# Altium schematic sheet adc front end.SchDoc
size A1
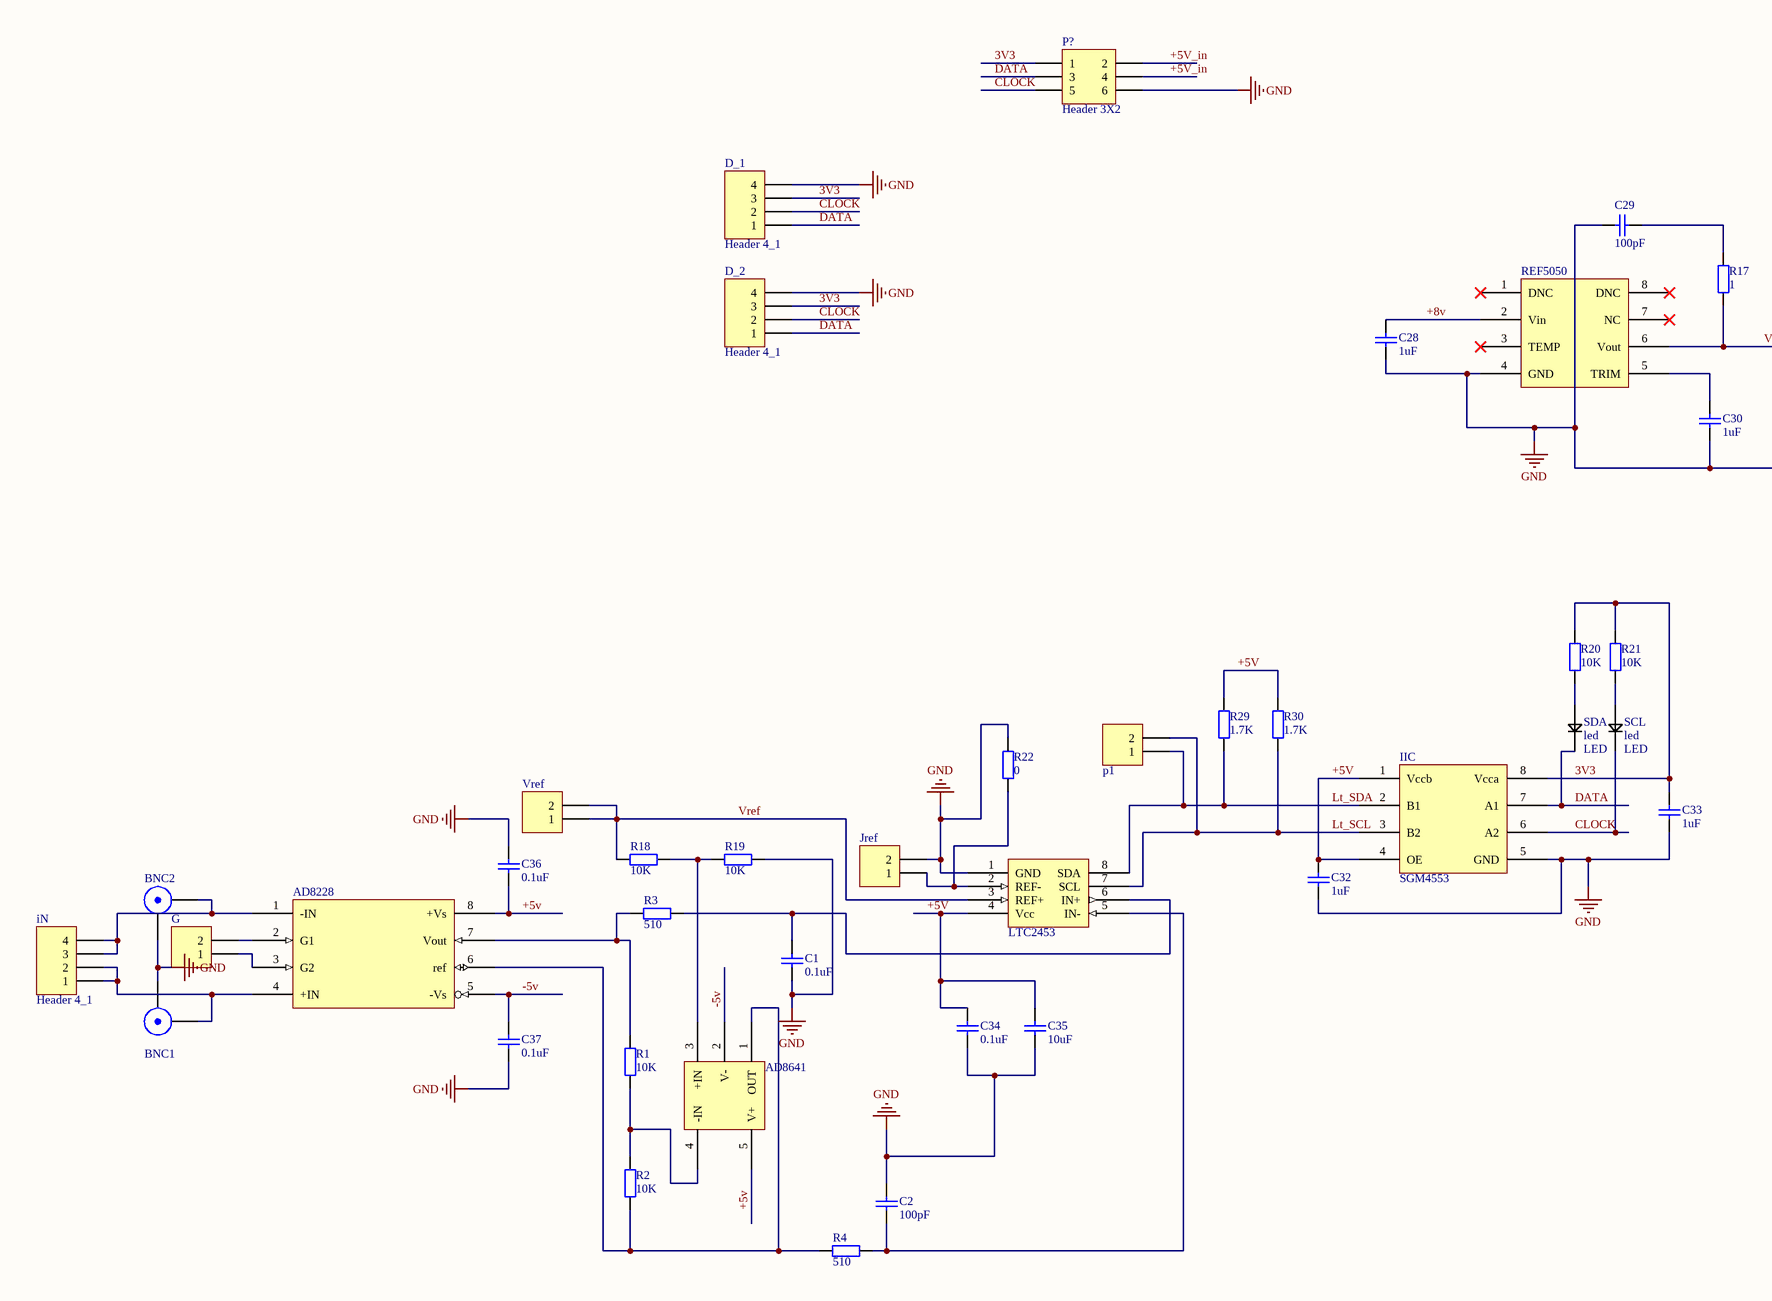
[diagram p0: adc front end.SchDoc, top left]
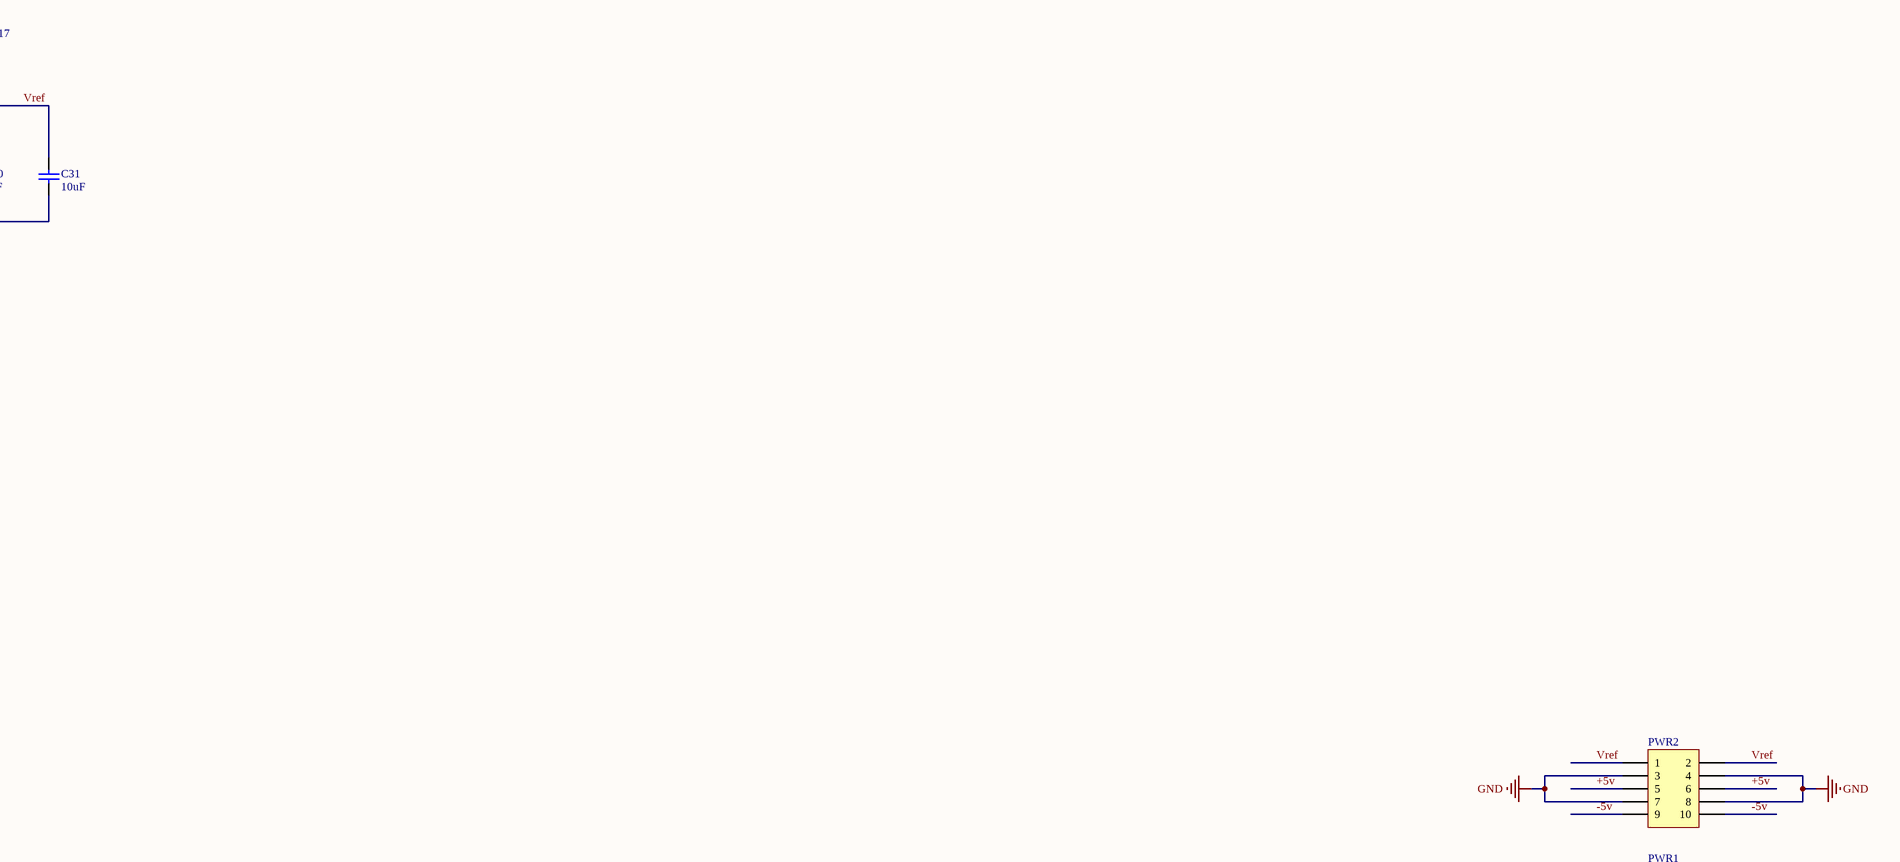
[diagram p1: adc front end.SchDoc, top right]
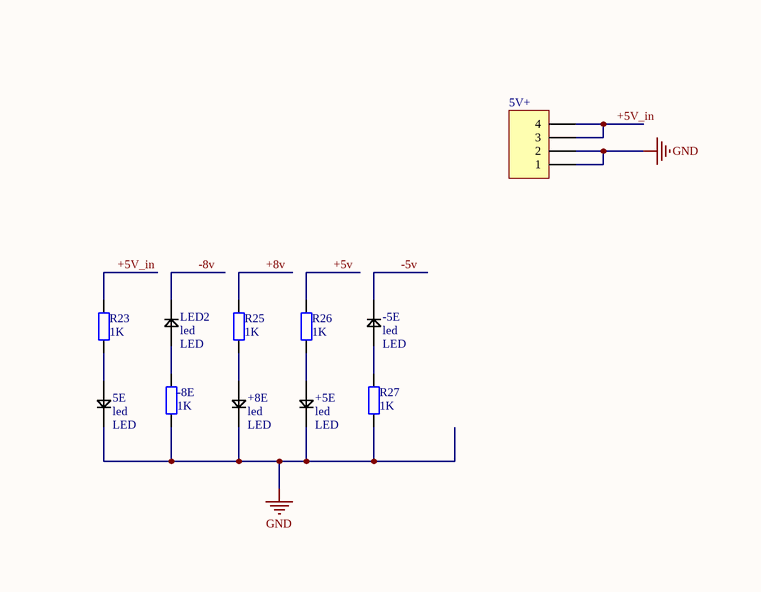
[diagram p2: adc front end.SchDoc, bottom left]
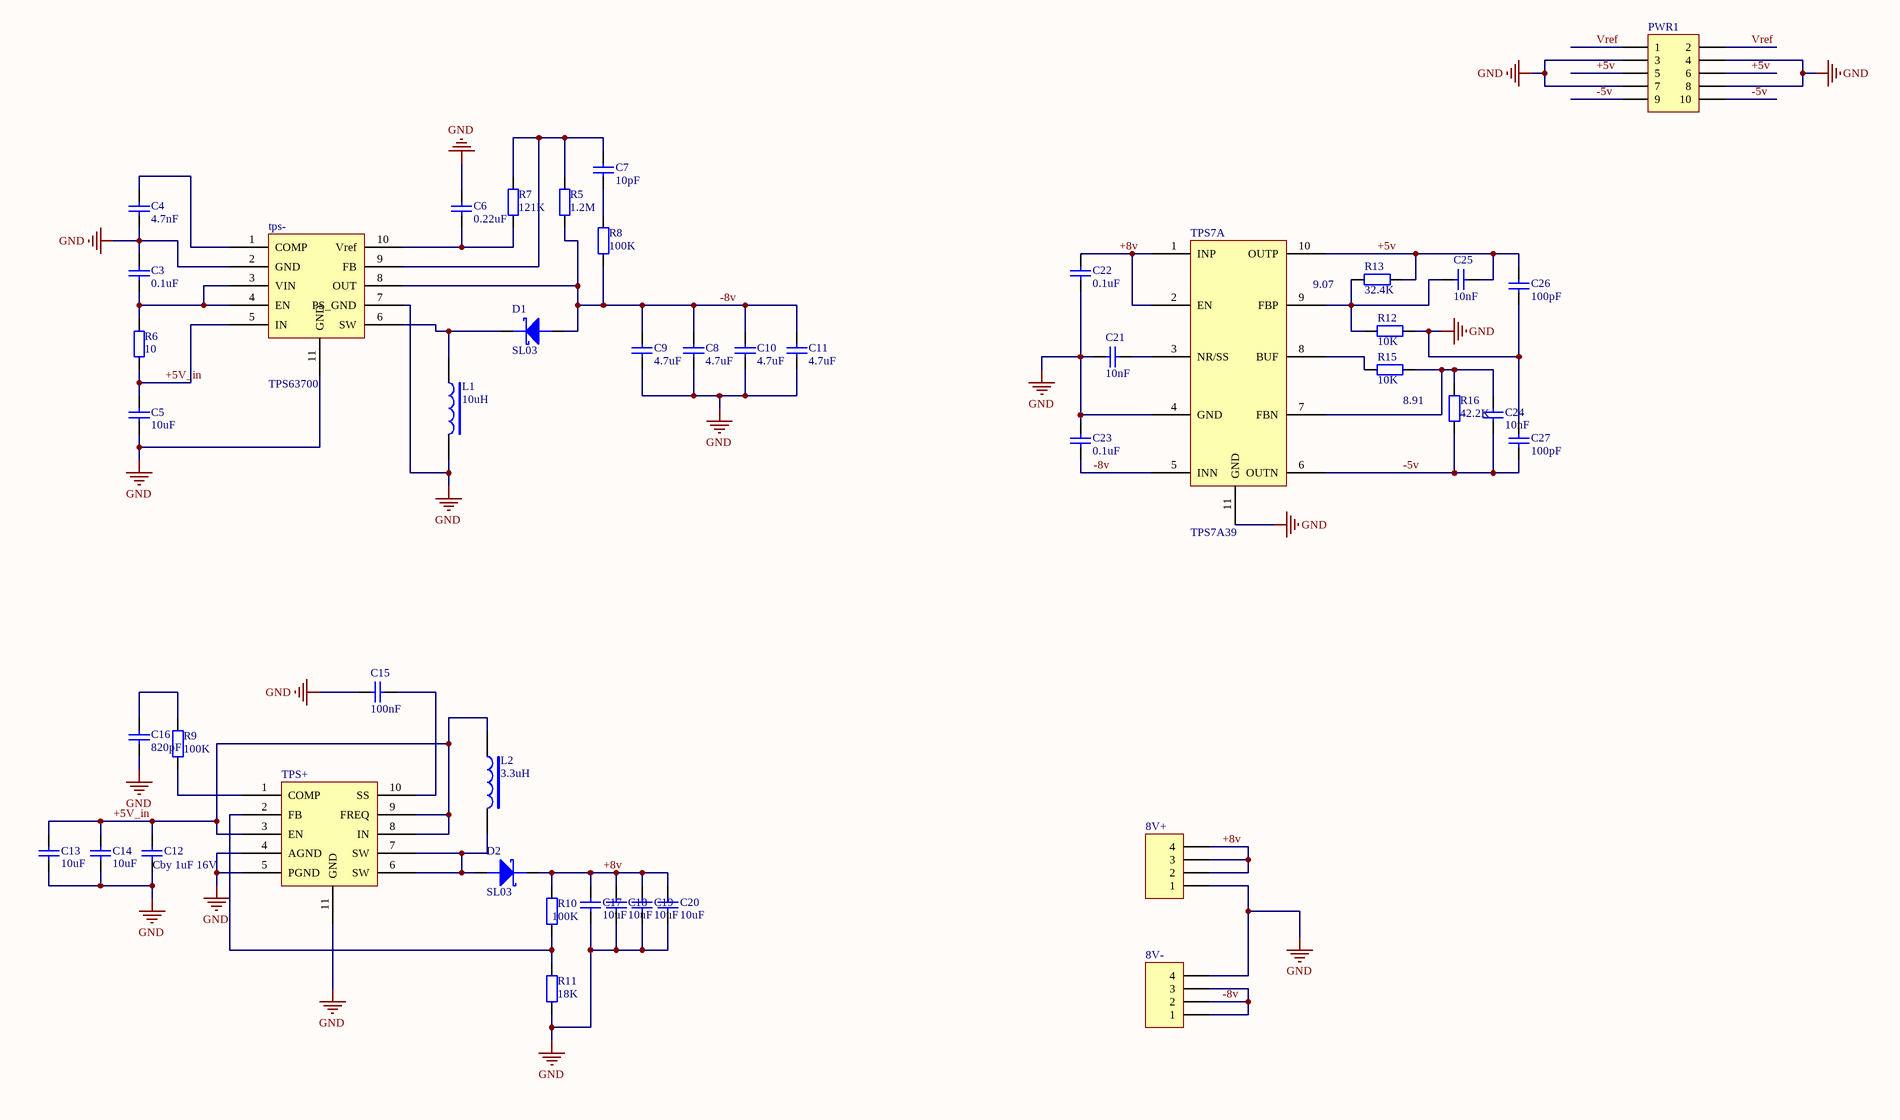
[diagram p3: adc front end.SchDoc, bottom right]

## Parts
5E  led  [LED_0805_RED]
5V+  Header 4_1  [HDR1X4]  (value not drawn)
8V+  Header 4_1  [HDR1X4]  (value not drawn)
8V-  Header 4_1  [HDR1X4]  (value not drawn)
+5E  led  [LED_0805_RED]
+8E  led  [LED_0805_RED]
-5E  led  [LED_0805_RED]
-8E  1K  [0603R]
AD8228  AD8228  [SI4435]  (value not drawn)
AD8641  AD8605  [SC-70 - 5]  (value not drawn)
BNC1  BNC  [BNC]  (value not drawn)
BNC2  BNC  [BNC]  (value not drawn)
C1  0.1uF  [C0603]
C2  100pF  [C0603]
C3  0.1uF  [C0603]
C4  4.7nF  [C0603]
C5  10uF  [0805c]
C6  0.22uF  [C0603]
C7  10pF  [C0603]
C8  4.7uF  [0805c]
C9  4.7uF  [0805c]
C10  4.7uF  [0805c]
C11  4.7uF  [0805c]
C12  Cby 1uF 16V  [C0603]
C13  10uF  [0805c]
C14  10uF  [0805c]
C15  100nF  [C0603]
C16  820pF  [C0603]
C17  10uF  [0805c]
C18  10uF  [0805c]
C19  10uF  [0805c]
C20  10uF  [0805c]
C21  10nF  [C0603]
C22  0.1uF  [C0603]
C23  0.1uF  [C0603]
C24  10nF  [C0603]
C25  10nF  [C0603]
C26  100pF  [0805c]
C27  100pF  [0805c]
C28  1uF  [0805c]
C29  100pF  [C0603]
C30  1uF  [0805c]
C31  10uF  [0805c]
C32  1uF  [C0603]
C33  1uF  [C0603]
C34  0.1uF  [C0603]
C35  10uF  [0805c]
C36  0.1uF  [C0603]
C37  0.1uF  [C0603]
D1  SL03  [DO-214AC]
D2  SL03  [DO-214AC]
D_1  Header 4_1  [HDR1X4]
D_2  Header 4_1  [HDR1X4]
G  Header 2_3  [HDR1X2]  (value not drawn)
IIC  SGM4553  [SOT-23-8]
iN  Header 4_1  [HDR1X4]
Jref  Header 2_3  [HDR1X2]  (value not drawn)
L1  10uH  [4012]
L2  3.3uH  [4012]
LED2  led  [LED_0805_RED]
LTC2453  LTC2453  [TSOT8]  (value not drawn)
p1  Header 2_3  [HDR1X2]  (value not drawn)
P?  Header 3X2  [HDR2X3]
PWR1  Header 5X2_3  [HDR2X5]  (value not drawn)
PWR2  Header 5X2_3  [HDR2X5]  (value not drawn)
R1  10K  [0603R]
R2  10K  [0603R]
R3  510  [0603R]
R4  510  [0603R]
R5  1.2M  [0603R]
R6  10  [0603R]
R7  121K  [0603R]
R8  100K  [0603R]
R9  100K  [0603R]
R10  100K  [0603R]
R11  18K  [0603R]
R12  10K  [0603R]
R13  32.4K  [0603R]
R15  10K  [0603R]
R16  42.2K  [0603R]
R17  1  [0603R]
R18  10K  [0603R]
R19  10K  [0603R]
R20  10K  [0603R]
R21  10K  [0603R]
R22  0  [0603R]
R23  1K  [0603R]
R25  1K  [0603R]
R26  1K  [0603R]
R27  1K  [0603R]
R29  1.7K  [0603R]
R30  1.7K  [0603R]
REF5050  ref5050  [VP230_Can]  (value not drawn)
SCL  led  [LED_0805_RED]
SDA  led  [LED_0805_RED]
TPS7A  TPS7A39  [WSON10-0.8]
TPS+  TPS61087  [WSON10-0.8]  (value not drawn)
tps-  TPS63700  [WSON10-0.8]
Vref  Header 2_3  [HDR1X2]  (value not drawn)

## Nets
GND: 5E.2 5V+.1 5V+.2 8V+.1 8V-.4 +5E.2 +8E.2 -8E.2 BNC1.2(Y) BNC2.2(Y) C1.1 C2.2 C3.2 C4.1 C5.1 C6.2 C8.1 C9.1 C10.1 C11.1 C12.1 C13.1 C14.1 C15.1 C16.2 C17.1 C18.1 C19.1 C20.1 C21.1 C22.1 C23.2 C26.1 C27.2 C28.1 C29.2 C30.1 C31.1 C32.2 C33.2 C34.2 C35.2 C36.1 C37.2 D_1.4 D_2.4 IIC.5(GND) Jref.2 L1.2 LTC2453.1(GND) P?.6 PWR1.3 PWR1.4 PWR1.7 PWR1.8 PWR2.3 PWR2.4 PWR2.7 PWR2.8 R11.1 R12.2 R19.2 R22.1 R27.2 REF5050.4(GND) TPS7A.4(GND) TPS7A.11(GND) TPS+.4(AGND) TPS+.5(PGND) TPS+.11(GND) tps-.2(GND) tps-.7(PS_GND) tps-.11(GND)
3V3: C33.1 D_1.3 D_2.3 IIC.8(Vcca) P?.1 R20.2 R21.2
+5v: AD8228.8(+Vs) AD8641.5(V+) C25.2 C26.2 C32.1 C34.1 C35.1 C36.2 IIC.1(Vccb) IIC.4(OE) LTC2453.4(Vcc) PWR1.5 PWR1.6 PWR2.5 PWR2.6 R13.1 R26.1 R29.2 R30.2 TPS7A.10(OUTP)
+5V_in: 5V+.3 5V+.4 C5.2 C12.2 C13.2 C14.2 L2.1 P?.2 P?.4 R6.1 R23.1 TPS+.3(EN) TPS+.8(IN) TPS+.9(FREQ) tps-.5(IN)
+8v: 8V+.2 8V+.3 8V+.4 C17.2 C18.2 C19.2 C20.2 C22.2 C28.2 D2.2(K) R10.2 R25.1 REF5050.2(Vin) TPS7A.1(INP) TPS7A.2(EN)
-5v: -5E.2 AD8228.5(-Vs) AD8641.2(V-) C24.1 C27.1 C37.1 PWR1.9 PWR1.10 PWR2.9 PWR2.10 R16.1 TPS7A.6(OUTN)
-8v: 8V-.1 8V-.2 8V-.3 C8.2 C9.2 C10.2 C11.2 C23.1 D1.1(A) LED2.2 R5.1 R8.1 TPS7A.5(INN) tps-.8(OUT)
CLOCK: D_1.2 D_2.2 IIC.6(A2) P?.5 SCL.2
DATA: D_1.1 D_2.1 IIC.7(A1) P?.3 SDA.2
Lt_SCL: IIC.3(B2) LTC2453.7(SCL) p1.2 R30.1
Lt_SDA: IIC.2(B1) LTC2453.8(SDA) p1.1 R29.1
Vref: C31.2 LTC2453.3(REF+) PWR1.1 PWR1.2 PWR2.1 PWR2.2 R17.1 R18.1 REF5050.6(Vout) Vref.1 Vref.2
Net5E_1: 5E.1 R23.2
Net+5E_1: +5E.1 R26.2
Net+8E_1: +8E.1 R25.2
Net-5E_1: -5E.1 R27.1
Net-8E_1: -8E.1 LED2.1
NetAD8228_1: AD8228.1(-IN) BNC2.1(X) iN.3 iN.4
NetAD8228_2: AD8228.2(G1) G.2
NetAD8228_3: AD8228.3(G2) G.1
NetAD8228_4: AD8228.4(+IN) BNC1.1(X) iN.1 iN.2
NetAD8228_6: AD8228.6(ref) AD8641.1(OUT) R2.1 R4.1
NetAD8228_7: AD8228.7(Vout) R1.2 R3.1
NetAD8641_3: AD8641.3(+IN) R18.2 R19.1
NetAD8641_4: AD8641.4(-IN) R1.1 R2.2
NetC1_2: C1.2 LTC2453.6(IN+) R3.2
NetC2_1: C2.1 LTC2453.5(IN-) R4.2
NetC3_1: C3.1 R6.2 tps-.3(VIN) tps-.4(EN)
NetC4_2: C4.2 tps-.1(COMP)
NetC6_1: C6.1 R7.1 tps-.10(Vref)
NetC7_1: C7.1 R8.2
NetC7_2: C7.2 R5.2 R7.2 tps-.9(FB)
NetC15_2: C15.2 TPS+.10(SS)
NetC16_1: C16.1 R9.2
NetC21_2: C21.2 TPS7A.3(NR/SS)
NetC24_2: C24.2 R15.2 R16.2 TPS7A.7(FBN)
NetC25_1: C25.1 R12.1 R13.2 TPS7A.9(FBP)
NetC29_1: C29.1 R17.2
NetC30_2: C30.2 REF5050.5(TRIM)
NetD1_2: D1.2(K) L1.1 tps-.6(SW)
NetD2_1: D2.1(A) L2.2 TPS+.6(SW) TPS+.7(SW)
NetJref_1: Jref.1 LTC2453.2(REF-) R22.2
NetR9_1: R9.1 TPS+.1(COMP)
NetR10_1: R10.1 R11.2 TPS+.2(FB)
NetR15_1: R15.1 TPS7A.8(BUF)
NetR20_1: R20.1 SDA.1
NetR21_1: R21.1 SCL.1

Not connected (* = marked no-connect by the designer): REF5050 1(DNC)* 3(TEMP)* 7(NC)* 8(DNC)*

## Notes on the sheet
- 9.07
- 8.91

## Library data of the parts
5E +5E +8E -5E LED2 SCL SDA = led: Resistor; Published: 8-Jun-2000; LatestRevisionDate: 17-Jul-2002; LatestRevisionNote: Re-released for DXP Platform.; PackageReference: AXIAL-0.3; Publisher: Altium Limited; Value: LED
5V+ 8V+ 8V- D_1 D_2 iN = Header 4_1: Header, 4-Pin; LatestRevisionDate: 17-Jul-2002; LatestRevisionNote: Re-released for DXP Platform.; Publisher: Altium Limited
-8E R1-R13 R15-R23 R25-R27 R29 R30 = Res2: Resistor; Published: 8-Jun-2000; LatestRevisionDate: 17-Jul-2002; LatestRevisionNote: Re-released for DXP Platform.; PackageReference: AXIAL-0.4; Publisher: Altium Limited
  -8E R23 R25-R27: Value: 1K
  R1 R2 R12 R15 R18-R21: Value: 10K
  R3 R4: Value: 510
  R5: Value: 1.2M
  R6: Value: 10
  R7: Value: 121K
  R8-R10: Value: 100K
  R11: Value: 18K
  R13: Value: 32.4K
  R16: Value: 42.2K
  R17: Value: 1
  R22: Value: 0
  R29 R30: Value: 1.7K
BNC1 BNC2 = BNC: BNC Connector
C1-C37 = Cap: Capacitor; Published: 8-Jun-2000; LatestRevisionDate: 17-Jul-2002; LatestRevisionNote: Re-released for DXP Platform.; PackageReference: RAD-0.3; Publisher: Altium Limited
  C1 C3 C22 C23 C34 C36 C37: Value: 0.1uF
  C2 C26 C27 C29: Value: 100pF
  C4: Value: 4.7nF
  C5 C13 C14 C17-C20 C31 C35: Value: 10uF
  C6: Value: 0.22uF
  C7: Value: 10pF
  C8-C11: Value: 4.7uF
  C12: Value: Cby 1uF 16V
  C15: Value: 100nF
  C16: Value: 820pF
  C21 C24 C25: Value: 10nF
  C28 C30 C32 C33: Value: 1uF
D1 D2 = 1N5817
G Jref p1 Vref = Header 2_3: Header, 2-Pin; LatestRevisionDate: 17-Jul-2002; LatestRevisionNote: Re-released for DXP Platform.; Publisher: Altium Limited
IIC = SGM4453
L1 L2 = INDUCTOR2
P? = Header 3X2: Header, 3-Pin, Dual row; LatestRevisionDate: 17-Jul-2002; LatestRevisionNote: Re-released for DXP Platform.; Publisher: Altium Limited
PWR1 PWR2 = Header 5X2_3: Header, 5-Pin, Dual row; LatestRevisionDate: 17-Jul-2002; LatestRevisionNote: Re-released for DXP Platform.; Publisher: Altium Limited